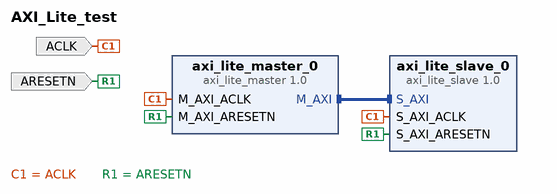
[diagram p0: block diagram of the top level]
# Vivado block design AXI_Lite_test, Vivado 2016.1
create_bd_design AXI_Lite_test

create_bd_port -dir I -type clk ACLK
set_property -dict {CONFIG.FREQ_HZ 100000000} [get_bd_ports ACLK]
create_bd_port -dir I -type rst ARESETN
set_property -dict {CONFIG.POLARITY ACTIVE_LOW} [get_bd_ports ARESETN]

create_bd_cell -type ip -vlnv PKUIMS_chenqiang:user:axi_lite_master:1.0 axi_lite_master_0
create_bd_cell -type ip -vlnv PKUIMS_chenqiang:user:axi_lite_slave:1.0 axi_lite_slave_0

# ---- connections ----

connect_bd_intf_net [get_bd_intf_pins axi_lite_master_0/M_AXI] [get_bd_intf_pins axi_lite_slave_0/S_AXI]
connect_bd_net [get_bd_ports ACLK] [get_bd_pins axi_lite_master_0/M_AXI_ACLK] [get_bd_pins axi_lite_slave_0/S_AXI_ACLK]
connect_bd_net [get_bd_ports ARESETN] [get_bd_pins axi_lite_master_0/M_AXI_ARESETN] [get_bd_pins axi_lite_slave_0/S_AXI_ARESETN]

# ---- address map ----
assign_bd_address -offset 0x44A00000 -range 64K -target_address_space [get_bd_addr_spaces axi_lite_master_0/M_AXI] [get_bd_addr_segs axi_lite_slave_0/S_AXI/reg0]

validate_bd_design
save_bd_design
